# Altium schematic sheet Chov3_led.SchDoc
size A4; DocumentNumber: 3; SheetNumber: 3; SheetTotal: 3; LotOfPieces: 1
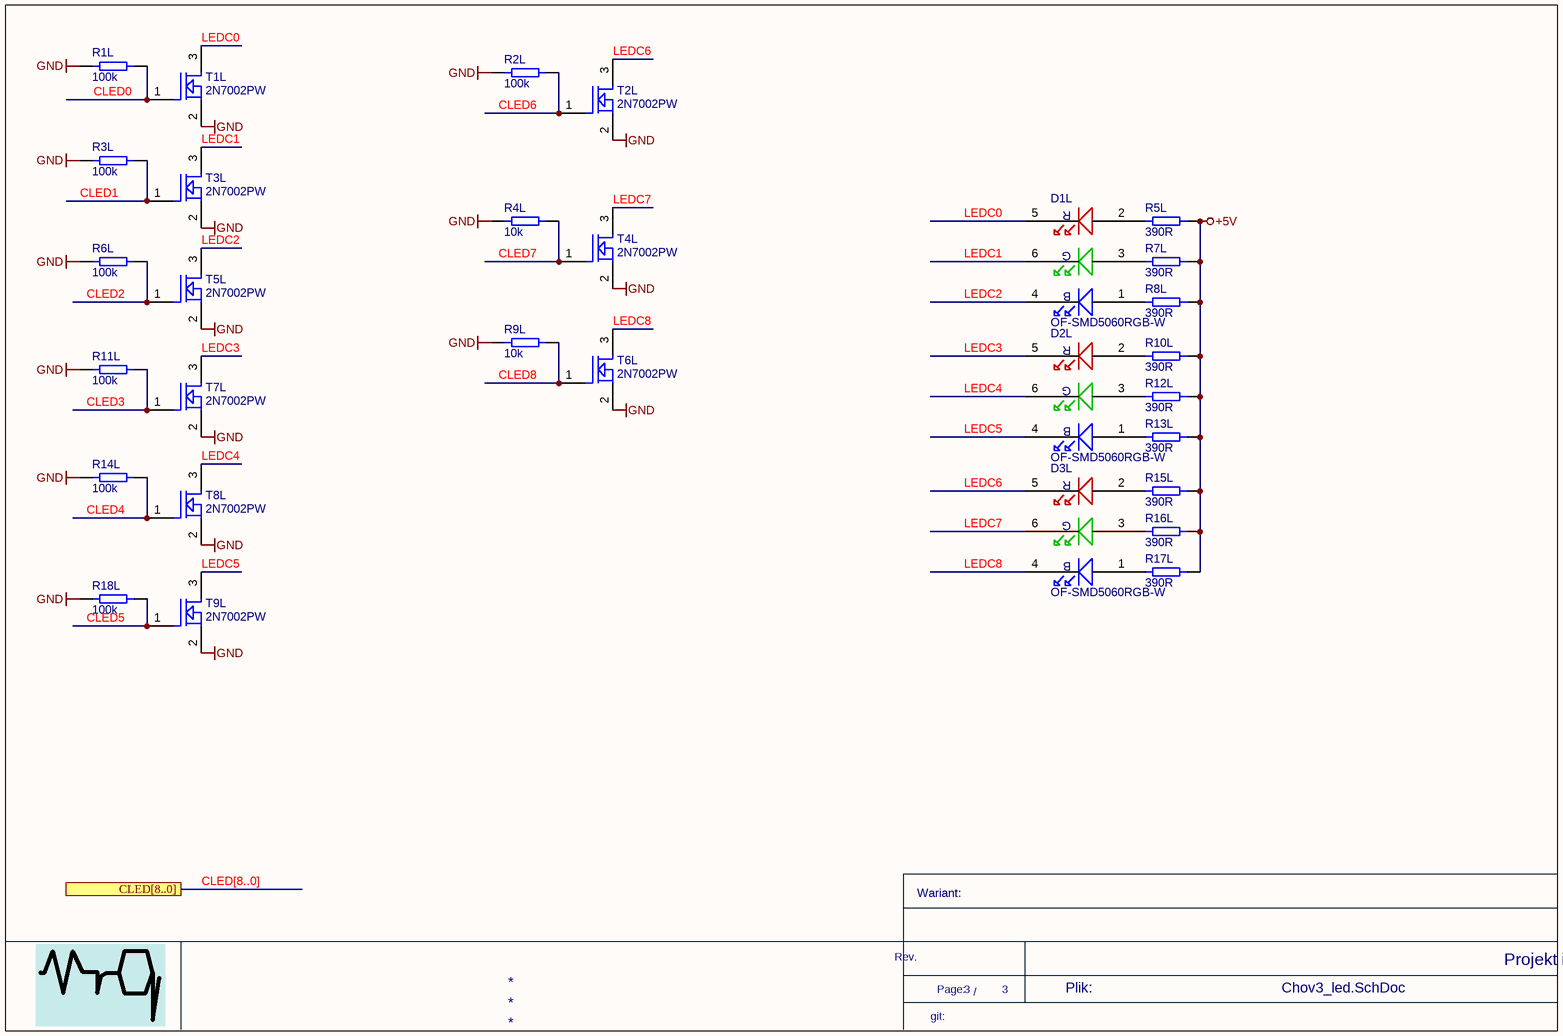
[diagram p0: Chov3_led.SchDoc]

## Parts
D1L  OF-SMD5060RGB-W  [OF-SMD5060RGB-W]
D2L  OF-SMD5060RGB-W  [OF-SMD5060RGB-W]
D3L  OF-SMD5060RGB-W  [OF-SMD5060RGB-W]
R1L  OtherParams: 100k  [0603-IPC]  (hidden comment: 0603SAF1003T5E)
R2L  OtherParams: 100k  [0603-IPC]  (hidden comment: 0603SAF1003T5E)
R3L  OtherParams: 100k  [0603-IPC]  (hidden comment: 0603SAF1003T5E)
R4L  OtherParams: 10k  [0603-IPC]  (hidden comment: 0603WGF10KT5E)
R5L  OtherParams: 390R  [0805]  (hidden comment: 0805WAF 390R T5E)
R6L  OtherParams: 100k  [0603-IPC]  (hidden comment: 0603SAF1003T5E)
R7L  OtherParams: 390R  [0805]  (hidden comment: 0805WAF 390R T5E)
R8L  OtherParams: 390R  [0805]  (hidden comment: 0805WAF 390R T5E)
R9L  OtherParams: 10k  [0603-IPC]  (hidden comment: 0603WGF10KT5E)
R10L  OtherParams: 390R  [0805]  (hidden comment: 0805WAF 390R T5E)
R11L  OtherParams: 100k  [0603-IPC]  (hidden comment: 0603SAF1003T5E)
R12L  OtherParams: 390R  [0805]  (hidden comment: 0805WAF 390R T5E)
R13L  OtherParams: 390R  [0805]  (hidden comment: 0805WAF 390R T5E)
R14L  OtherParams: 100k  [0603-IPC]  (hidden comment: 0603SAF1003T5E)
R15L  OtherParams: 390R  [0805]  (hidden comment: 0805WAF 390R T5E)
R16L  OtherParams: 390R  [0805]  (hidden comment: 0805WAF 390R T5E)
R17L  OtherParams: 390R  [0805]  (hidden comment: 0805WAF 390R T5E)
R18L  OtherParams: 100k  [0603-IPC]  (hidden comment: 0603SAF1003T5E)
T1L  2N7002PW  [SOT323-3_FLOW]
T2L  2N7002PW  [SOT323-3_FLOW]
T3L  2N7002PW  [SOT323-3_FLOW]
T4L  2N7002PW  [SOT323-3_FLOW]
T5L  2N7002PW  [SOT323-3_FLOW]
T6L  2N7002PW  [SOT323-3_FLOW]
T7L  2N7002PW  [SOT323-3_FLOW]
T8L  2N7002PW  [SOT323-3_FLOW]
T9L  2N7002PW  [SOT323-3_FLOW]

## Ports
CLED[8..0]

## Nets
+5V: R5L.2 R7L.2 R8L.2 R10L.2 R12L.2 R13L.2 R15L.2 R16L.2 R17L.2
GND: R1L.1 R2L.1 R3L.1 R4L.1 R6L.1 R9L.1 R11L.1 R14L.1 R18L.1 T1L.2(SOURCE) T2L.2(SOURCE) T3L.2(SOURCE) T4L.2(SOURCE) T5L.2(SOURCE) T6L.2(SOURCE) T7L.2(SOURCE) T8L.2(SOURCE) T9L.2(SOURCE)
CLED0: R1L.2 T1L.1(GATE)
CLED1: R3L.2 T3L.1(GATE)
CLED2: R6L.2 T5L.1(GATE)
CLED3: R11L.2 T7L.1(GATE)
CLED4: R14L.2 T8L.1(GATE)
CLED5: R18L.2 T9L.1(GATE)
CLED6: R2L.2 T2L.1(GATE)
CLED7: R4L.2 T4L.1(GATE)
CLED8: R9L.2 T6L.1(GATE)
LEDC0: D1L.5(CATH) T1L.3(DRAIN)
LEDC1: D1L.6(CATH) T3L.3(DRAIN)
LEDC2: D1L.4(CATH) T5L.3(DRAIN)
LEDC3: D2L.5(CATH) T7L.3(DRAIN)
LEDC4: D2L.6(CATH) T8L.3(DRAIN)
LEDC5: D2L.4(CATH) T9L.3(DRAIN)
LEDC6: D3L.5(CATH) T2L.3(DRAIN)
LEDC7: D3L.6(CATH) T4L.3(DRAIN)
LEDC8: D3L.4(CATH) T6L.3(DRAIN)
NetD1L_1: D1L.1(ANOD) R8L.1
NetD1L_2: D1L.2(ANOD) R5L.1
NetD1L_3: D1L.3(ANOD) R7L.1
NetD2L_1: D2L.1(ANOD) R13L.1
NetD2L_2: D2L.2(ANOD) R10L.1
NetD2L_3: D2L.3(ANOD) R12L.1
NetD3L_1: D3L.1(ANOD) R17L.1
NetD3L_2: D3L.2(ANOD) R15L.1
NetD3L_3: D3L.3(ANOD) R16L.1

## Buses and harness runs
bus CLED[8..0] = port CLED[8..0]

## Notes on the sheet
- Wariant:
- Rev.
- /
- Projekt i wykonanie: (C) Miroslaw Lach MRQ, www.mlach.com
- git:
- Page:
- Plik:
- (in symbol OF-SMD5060RGB-W[[/\]]5060) R; G; B

## Library data of the parts
D1L D2L D3L = OF-SMD5060RGB-W[[/\]]5060: Descript: 5050 Single Chip RGB Color Top LED; Currency5: PLN; Value: OF-SMD5060RGB-W; Dimensions: 5060; Supplier5: tme.pl; Reference5: OF-SMD5060RGB-W; Manufacturer5: Optoflash; Typ5: OF-SMD5060RGB-W; Price5: 1,3206; DateOfPrice5: 2014-01-04
R1L R2L R3L R6L R11L R14L R18L = 0603SAF1003T5E[[/\]]0603[[/\]]0.1W[[/\]]1%[[/\]]100k: DissPower: 0.1W; Tolerance: 1%; Descript: Rezystor: thick film; SMD; 0603; 100k?; 0,1W; ±1%; -55÷125°C; Reference5: SMD0603-100K-1%; Currency5: PLN; Value: 0603SAF1003T5E; Dimensions: 0603; Supplier5: tme.pl; Manufacturer5: Royal Ohm; Typ5: 0603SAF1003T5E; Price5: 0,02511; DateOfPrice5: 2016-02-11
R4L R9L = 0603WGF10KT5E[[/\]]0603[[/\]]0.1W[[/\]]1%[[/\]]10k: DissPower: 0.1W; Tolerance: 1%; Descript: Resistor 10kohm, 0603, 1%; Reference5: SMD0603-10K-1%; Currency5: PLN; Value: 0603WGF10KT5E; Dimensions: 0603; Supplier5: tme.pl; Manufacturer5: Royal Ohm; Typ5: 0603WGF 10K T5E; Price5: 0,02755; DateOfPrice5: 2016-06-02
R5L R7L R8L R10L R12L R13L R15L R16L R17L = 0805WAF 390R T5E[[/\]]0805[[/\]]0.125W[[/\]]1%[[/\]]390R: DissPower: 0.125W; Tolerance: 1%; Descript: Resistor 390ohm, 0805, 1%; Reference5: SMD0805-390R-1%; Currency5: PLN; Value: 0805WAF 390R T5E; Dimensions: 0805; Supplier5: tme.pl; Manufacturer5: Royal Ohm; Typ5: 0805WAF 390R T5E; Price5: 0,029; DateOfPrice5: 2013-06-18
T1L T2L T3L T4L T5L T6L T7L T8L T9L = 2N7002PW[[/\]]SOT323-3: Descript: N-channel enhacement-mode vertical DMOS FET; Reference5: 1829184; Currency5: PLN; Value: 2N7002PW; Dimensions: SOT323-3; Supplier5: farnell.com; Price5: 0,88; DateOfPrice5: 2016-04-09; Manufacturer5: NXP; Typ5: 2N7002PW